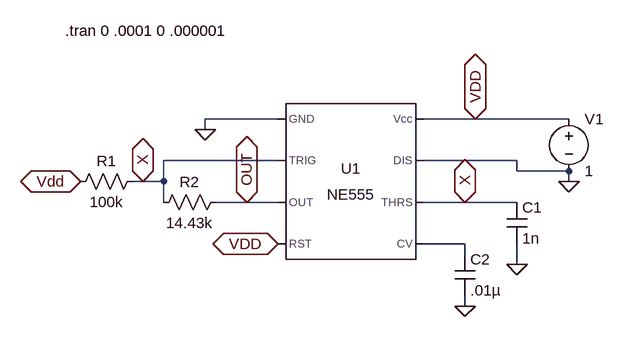
[diagram p0: schematic 555timer_simulation.asc]
555timer_simulation.asc, the LTspice schematic file:
Version 4
SHEET 1 888 680
WIRE 336 224 224 224
WIRE 640 224 560 224
WIRE 784 224 640 224
WIRE 224 240 224 224
WIRE 336 288 160 288
WIRE 704 288 560 288
WIRE 704 304 704 288
WIRE 784 304 704 304
WIRE 128 320 112 320
WIRE 160 320 160 288
WIRE 160 320 128 320
WIRE 784 320 784 304
WIRE 160 352 160 320
WIRE 288 352 240 352
WIRE 336 352 288 352
WIRE 624 352 560 352
WIRE 704 352 624 352
WIRE 624 416 560 416
WIRE 624 432 624 416
WIRE 704 448 704 416
WIRE 624 512 624 496
FLAG 224 240 0
FLAG 640 224 VDD
IOPIN 640 224 BiDir
FLAG 336 416 VDD
IOPIN 336 416 BiDir
FLAG 32 320 Vdd
IOPIN 32 320 BiDir
FLAG 128 320 X
IOPIN 128 320 BiDir
FLAG 624 352 X
IOPIN 624 352 BiDir
FLAG 784 320 0
FLAG 624 512 0
FLAG 704 448 0
FLAG 288 352 OUT
IOPIN 288 352 BiDir
SYMBOL Misc/NE555 448 320 R0
SYMATTR InstName U1
SYMBOL voltage 784 208 R0
SYMATTR InstName V1
SYMATTR Value 1
SYMBOL res 128 304 R90
WINDOW 0 0 56 VBottom 2
WINDOW 3 32 56 VTop 2
SYMATTR InstName R1
SYMATTR Value 100k
SYMBOL cap 688 352 R0
SYMATTR InstName C1
SYMATTR Value 1n
SYMBOL cap 608 432 R0
SYMATTR InstName C2
SYMATTR Value .01µ
SYMBOL res 256 336 R90
WINDOW 0 0 56 VBottom 2
WINDOW 3 32 56 VTop 2
SYMATTR InstName R2
SYMATTR Value 14.43k
TEXT 8 88 Left 2 !.tran 0 .0001 0 .000001

The netlist it stands for:
* 555timer_simulation.asc
XU1 0 X OUT VDD N001 X 0 VDD NE555  ; pins GND TRIG OUT RST CV THRS DIS Vcc
V1 VDD 0 1
R1 X VDD 100k
C1 X 0 1n
C2 N001 0 .01µ
R2 OUT X 14.43k
.tran 0 .0001 0 .000001
.lib NE555.sub
.backanno
.end